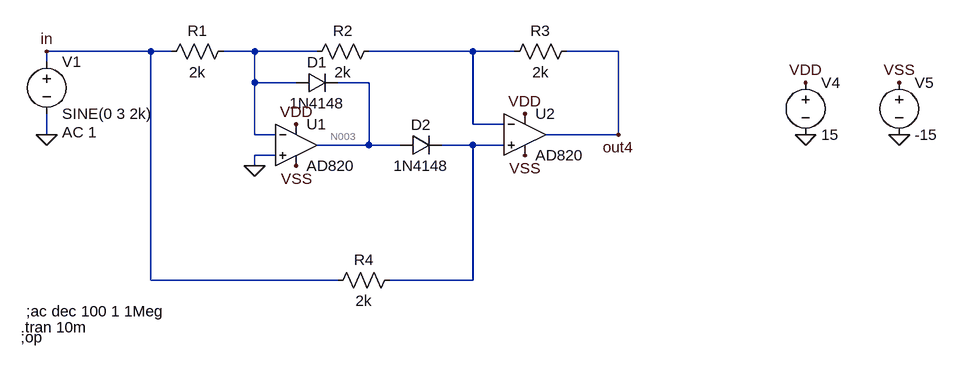
[diagram p0: schematic Etaj 4.asc]
Etaj 4.asc, the LTspice schematic file:
Version 4
SHEET 1 1076 680
WIRE -144 -64 -304 -64
WIRE -112 -64 -144 -64
WIRE 16 -64 -32 -64
WIRE 112 -64 16 -64
WIRE 352 -64 192 -64
WIRE 416 -64 352 -64
WIRE 576 -64 496 -64
WIRE -304 -48 -304 -64
WIRE 16 -16 16 -64
WIRE 80 -16 16 -16
WIRE 192 -16 144 -16
WIRE 352 48 352 -64
WIRE 400 48 352 48
WIRE -304 64 -304 32
WIRE 16 64 16 -16
WIRE 48 64 16 64
WIRE 576 64 576 -64
WIRE 576 64 464 64
WIRE 192 80 192 -16
WIRE 192 80 112 80
WIRE 240 80 192 80
WIRE 352 80 304 80
WIRE 400 80 352 80
WIRE 48 96 16 96
WIRE 16 112 16 96
WIRE -144 288 -144 -64
WIRE 144 288 -144 288
WIRE 352 288 352 80
WIRE 352 288 224 288
FLAG 16 112 0
FLAG -304 64 0
FLAG 80 48 VDD
FLAG 432 32 VDD
FLAG 80 112 VSS
FLAG 432 96 VSS
FLAG 576 64 out4
FLAG -304 -64 in
FLAG 864 64 0
FLAG 1008 64 0
FLAG 864 -16 VDD
FLAG 1008 -16 VSS
SYMBOL res -16 -80 R90
WINDOW 0 0 56 VBottom 2
WINDOW 3 32 56 VTop 2
SYMATTR InstName R1
SYMATTR Value 2k
SYMBOL res 208 -80 R90
WINDOW 0 0 56 VBottom 2
WINDOW 3 32 56 VTop 2
SYMATTR InstName R2
SYMATTR Value 2k
SYMBOL res 512 -80 R90
WINDOW 0 0 56 VBottom 2
WINDOW 3 32 56 VTop 2
SYMATTR InstName R3
SYMATTR Value 2k
SYMBOL res 240 272 R90
WINDOW 0 0 56 VBottom 2
WINDOW 3 32 56 VTop 2
SYMATTR InstName R4
SYMATTR Value 2k
SYMBOL voltage -304 -64 R0
WINDOW 123 24 124 Left 2
WINDOW 39 0 0 Left 0
SYMATTR Value2 AC 1
SYMATTR InstName V1
SYMATTR Value SINE(0 3 2k)
SYMBOL diode 80 0 R270
WINDOW 0 32 32 VTop 2
WINDOW 3 0 32 VBottom 2
SYMATTR InstName D1
SYMATTR Value 1N4148
SYMBOL diode 240 96 R270
WINDOW 0 32 32 VTop 2
WINDOW 3 0 32 VBottom 2
SYMATTR InstName D2
SYMATTR Value 1N4148
SYMBOL voltage 864 -32 R0
WINDOW 123 0 0 Left 0
WINDOW 39 0 0 Left 0
SYMATTR InstName V4
SYMATTR Value 15
SYMBOL voltage 1008 -32 R0
WINDOW 123 0 0 Left 0
WINDOW 39 0 0 Left 0
SYMATTR InstName V5
SYMATTR Value -15
SYMBOL OpAmps\\AD820 432 0 R0
SYMATTR InstName U2
SYMBOL OpAmps\\AD820 80 16 R0
SYMATTR InstName U1
TEXT -336 336 Left 2 !;ac dec 100 1 1Meg
TEXT -344 360 Left 2 !.tran 10m
TEXT -344 376 Left 2 !;op

The netlist it stands for:
* Etaj 4.asc
R1 N001 in 2k
R2 N002 N001 2k
R3 out4 N002 2k
R4 N004 in 2k
V1 in 0 SINE(0 3 2k) AC 1
D1 N001 N003 1N4148
D2 N003 N004 1N4148
V4 VDD 0 15
V5 VSS 0 -15
XU2 N004 N002 VDD VSS out4 AD820  ; pins In+ In- V+ V- OUT
XU1 0 N001 VDD VSS N003 AD820  ; pins In+ In- V+ V- OUT
.model D D
.lib standard.dio
;ac dec 100 1 1Meg
.tran 10m
;op
.backanno
.end

* Results of the author's LTspice run, read from the files saved beside the schematic
* Operating Point, zero values left out:
*   V(n003) = 35.95 µV
*   V(vdd) = 15 V
*   V(vss) = -15 V
*   I(D1) = -1.999 pA
*   I(D2) = 2 pA
*   I(R3) = 2.001 pA
*   I(V4) = -1.415 mA
*   I(V5) = 1.415 mA
*   Ix(u2:1) = 2 pA
*   Ix(u2:2) = 2 pA
*   Ix(u2:3) = 707.5 µA
*   Ix(u2:4) = -707.5 µA
*   Ix(u2:5) = -2.001 pA
*   Ix(u1:1) = 2 pA
*   Ix(u1:2) = 2 pA
*   Ix(u1:3) = 707.5 µA
*   Ix(u1:4) = -707.5 µA
*   Ix(u1:5) = -3.999 pA
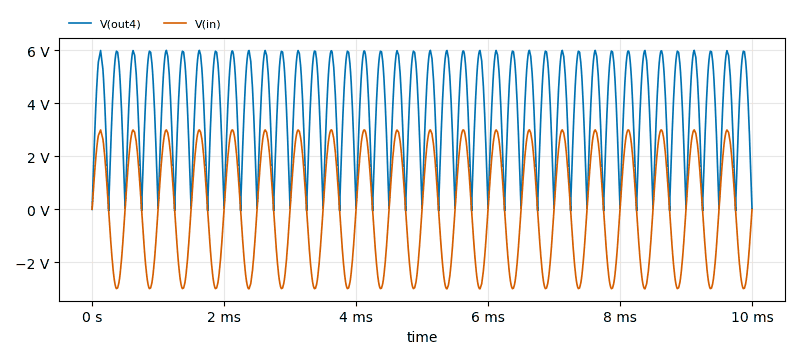
[diagram p1: Transient Analysis of Etaj 4.asc, plotted from the saved traces]
* Transient Analysis, 1 run:
*   V(out4): min -53.45 mV, max 5.999 V, average 3.8 V, rms 4.224 V, last 32.34 mV
*   V(in): min -2.997 V, max 3 V, average -300.9 µV, rms 2.118 V, last 0 V